# EAGLE design DummyLoad (EAGLE 7.2.0)
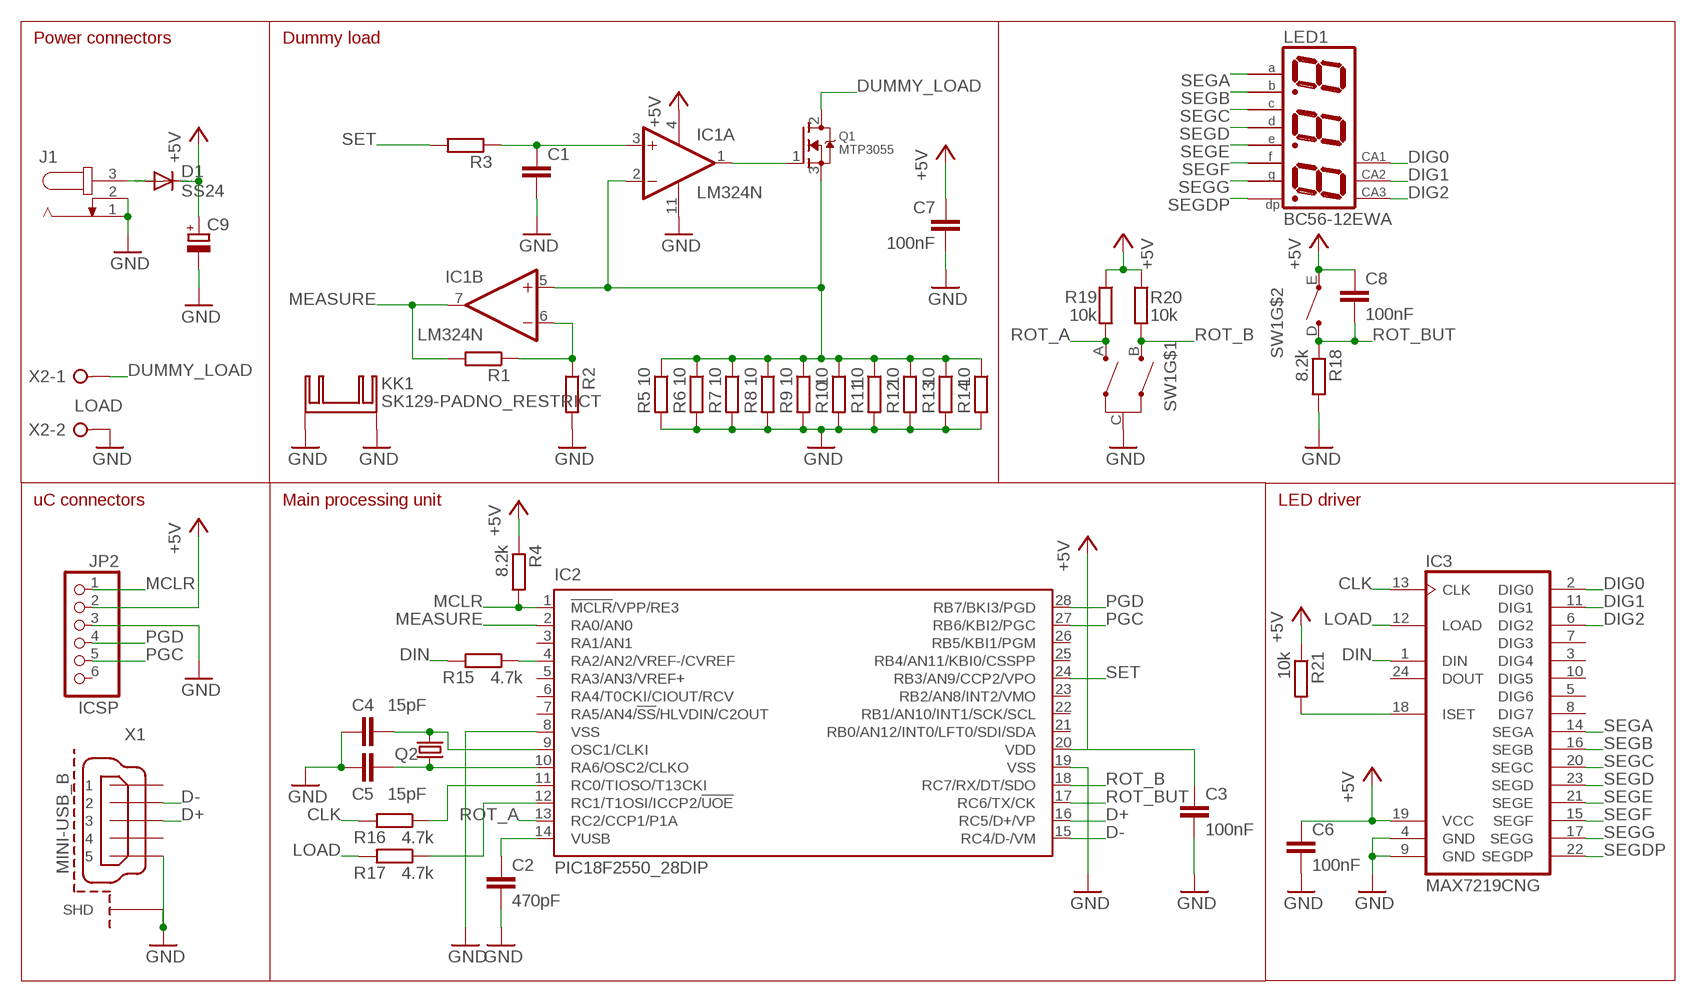
[diagram p0: schematic, sheet 1]

## Parts
C1  C-EUC1206  [C1206]
C2  470pF  C-EUC1206  [C1206]
C3  100nF  C-EUC1206  [C1206]
C4  15pF  C-EUC1206  [C1206]
C5  15pF  C-EUC1206  [C1206]
C6  100nF  C-EUC1206  [C1206]
C7  100nF  C-EUC1206  [C1206]
C8  100nF  C-EUC1206  [C1206]
C9  CPOL-EUD/7343-31R  [D/7343-31R]
D1  SS24  DIODE-DO214AA  [DO214AA]
IC1  LM324N  [DIL14]
IC2  PIC18F2550_28DIP  [DIL28-3]
IC3  MAX7219CNG  [DIL24-3]
J1  JACK-PLUG0  [SPC4077]
JP2  ICSP  PINHD-1X6/90  [1X06/90]
KK1  SK129-PADNO_RESTRICT  [SK129-NO_RESTRICT]
LED1  BC56-12EWA  [BX56-12]
Q1  MTP3055  MOSFET-NGDS_TO220V  [TO220V]
Q2  CRYSTALHC49S  [HC49/S]
R1  R-EU_R1206  [R1206]
R2  R-EU_R1206  [R1206]
R3  R-EU_R1206  [R1206]
R4  8.2k  R-EU_R1206  [R1206]
R5  10  R-EU_0309/12  [0309/12]
R6  10  R-EU_0309/12  [0309/12]
R7  10  R-EU_0309/12  [0309/12]
R8  10  R-EU_0309/12  [0309/12]
R9  10  R-EU_0309/12  [0309/12]
R10  10  R-EU_0309/12  [0309/12]
R11  10  R-EU_0309/12  [0309/12]
R12  10  R-EU_0309/12  [0309/12]
R13  10  R-EU_0309/12  [0309/12]
R14  10  R-EU_0309/12  [0309/12]
R15  4.7k  R-EU_R1206  [R1206]
R16  4.7k  R-EU_R1206  [R1206]
R17  4.7k  R-EU_R1206  [R1206]
R18  8.2k  R-EU_R1206  [R1206]
R19  10k  R-EU_R1206  [R1206]
R20  10k  R-EU_R1206  [R1206]
R21  10k  R-EU_R1206  [R1206]
SW1  EC11B-V-T  [EC11B-V]
X1  MINI-USB_B  [MINI-USB-B]
X2  LOAD  W237-02P  [W237-132]

## Nets
+5V: C3.1 C6.1 C7.1 C8.1 C9.+ D1.C IC1.4(P:V+) IC2.20(VDD) IC3.19(VCC) JP2.2 R4.1 R19.1 R20.1 R21.1 SW1.E
CLK: IC3.13(CLK) R16.2
D+: IC2.16(RC5/D+/VP) X1.3
D-: IC2.15(RC4/D-/VM) X1.2
DIG0: IC3.2(DIG0) LED1.12(CA)
DIG1: IC3.11(DIG1) LED1.9(CA)
DIG2: IC3.6(DIG2) LED1.8(CA)
DIN: IC3.1(DIN) R15.2
DUMMY_LOAD: Q1.2(D) X2.1
GND: C1.2 C2.2 C3.2 C4.1 C5.1 C6.2 C7.2 C9.- IC1.11(P:V-) IC2.8(VSS) IC2.19(VSS) IC3.4(GND) IC3.9(GND) J1.1 J1.2 JP2.3 KK1.A2,5(K) KK1.B2,5(K) R2.2 R5.2 R6.2 R7.2 R8.2 R9.2 R10.2 R11.2 R12.2 R13.2 R14.2 R18.2 SW1.C X1.5 X1.M1(SHD) X1.M2(SHD) X1.M3(SHD) X1.M4(SHD) X2.2
LOAD: IC3.12(LOAD) R17.2
MCLR: IC2.1(!MCLR!/VPP/RE3) JP2.1 R4.2
MEASURE: IC1.7(B:OUT) IC2.2(RA0/AN0) R1.2
N$1: IC1.1(A:OUT) Q1.1(G)
N$2: IC1.2(A:-IN) IC1.5(B:+IN) Q1.3(S) R5.1 R6.1 R7.1 R8.1 R9.1 R10.1 R11.1 R12.1 R13.1 R14.1
N$3: C4.2 IC2.9(OSC1/CLKI) Q2.2
N$4: IC1.6(B:-IN) R1.1 R2.1
N$5: C2.1 IC2.14(VUSB)
N$6: C1.1 IC1.3(A:+IN) R3.1
N$7: C5.2 IC2.10(RA6/OSC2/CLKO) Q2.1
N$8: IC2.4(RA2/AN2/VREF-/CVREF) R15.1
N$9: IC2.11(RC0/TIOSO/T13CKI) R16.1
N$10: IC2.12(RC1/T1OSI/ICCP2/!UOE) R17.1
N$11: D1.A J1.3
N$13: IC3.18(ISET) R21.2
PGC: IC2.27(RB6/KBI2/PGC) JP2.5
PGD: IC2.28(RB7/BKI3/PGD) JP2.4
ROT_A: IC2.13(RC2/CCP1/P1A) R19.2 SW1.A
ROT_B: IC2.18(RC7/RX/DT/SDO) R20.2 SW1.B
ROT_BUT: C8.2 IC2.17(RC6/TX/CK) R18.1 SW1.D
SEGA: IC3.14(SEGA) LED1.11(A)
SEGB: IC3.16(SEGB) LED1.7(B)
SEGC: IC3.20(SEGC) LED1.4(C)
SEGD: IC3.23(SEGD) LED1.2(D)
SEGDP: IC3.22(SEGDP) LED1.3(DP)
SEGE: IC3.21(SEGE) LED1.1(E)
SEGF: IC3.15(SEGF) LED1.10(F)
SEGG: IC3.17(SEGG) LED1.5(G)
SET: IC2.24(RB3/AN9/CCP2/VPO) R3.2
Unconnected: IC1.8(C:OUT) IC1.9(C:-IN) IC1.10(C:+IN) IC1.12(D:+IN) IC1.13(D:-IN) IC1.14(D:OUT) IC2.3(RA1/AN1) IC2.5(RA3/AN3/VREF+) IC2.6(RA4/T0CKI/CIOUT/RCV) IC2.7(RA5/AN4/!SS!/HLVDIN/C2OUT) IC2.21(RB0/AN12/INT0/LFT0/SDI/SDA) IC2.22(RB1/AN10/INT1/SCK/SCL) IC2.23(RB2/AN8/INT2/VMO) IC2.25(RB4/AN11/KBI0/CSSPP) IC2.26(RB5/KBI1/PGM) IC3.3(DIG4) IC3.5(DIG6) IC3.7(DIG3) IC3.8(DIG7) IC3.10(DIG5) IC3.24(DOUT) JP2.6 X1.1 X1.4

## Notes on the sheet
- Power connectors | Dummy load
- uC connectors | Main processing unit | LED driver

## Library data of the parts
C1-C8 = rcl:C-EU: CAPACITOR, European symbol
C9 = rcl:CPOL-EU: POLARIZED CAPACITOR, European symbol
D1 = diode:DIODE-: DIODE
IC1 = linear:LM324: OP AMP
IC2 = microchip:PIC18F2*_28: USB Microcontrollers with nanoWatt Technology High-Performance, Enhanced Flash, 28/40/44-Pin, Source: http://ww1.microchip.com/downloads/en/devicedoc/39632c.pdf; MF: MICROCHIP; MPN: PIC18F2550-I/SP; OC_FARNELL: 1523822; OC_NEWARK: 80K6054
IC3 = maxim:MAX7219CNG: LED DISPLAY DRIVER; MF: MAXIM; MPN: MAX7219CNG; OC_FARNELL: 1523914; OC_NEWARK: 34C4018
J1 = con-jack:JACK-PLUG: DC POWER JACK Power Jack, DC, Right Angle, Through Hole, Rated 5A at 16VDC, PC Terminals Distributor: Farnell (www.Farnell.de) Drawing: 84N1161.pdf / 84N1162.pdf Manufacturer: SPC Technology (www.spctechnology.com) Type: SPC4077 / SPC 4078; OC_FARNELL: unknown; OC_NEWARK: unknown
JP2 = pinhead:PINHD-1X6: PIN HEADER
KK1 = own-collection:SK129-PAD: HEATSINK manufacturer Fischer/distributor Buerklin
LED1 = display-kingbright:B?56-12*WA: 14.22mm (0.56INCH) THREE DIGIT NUMERIC DISPLAY Source: http://www.kingbright.com .. BA56-11EWA(Ver1189474895.pdf; OC_FARNELL: unknown; OC_NEWARK: unknown
Q1 = adafruit:MOSFET-N: N-Channel Mosfet 2N7002E - 60V 260mA SOT23 [Digikey: 2N7002ET1GOSTR-ND] - REEL BSH103 - 30V 850mA SOT23 [Digikey: 568-5013-1-ND]
Q2 = adafruit:CRYSTAL: CRYSTAL; OC_FARNELL: 1667008; OC_NEWARK: unknown
R1-R21 = rcl:R-EU_: RESISTOR, European symbol
SW1 = alps:EC11B-V-T: ALPS EC11B Vertikal mit Taster Drehimpulsgeber 11mm
X1 = own-collection:MINI-USB_B: MINI USB-B R/A DIP 5pol. Source: www.cypressindustries.com
X2 = con-wago-508:W237-02P: WAGO SREW CLAMP; OC_FARNELL: unknown; OC_NEWARK: unknown

## Board
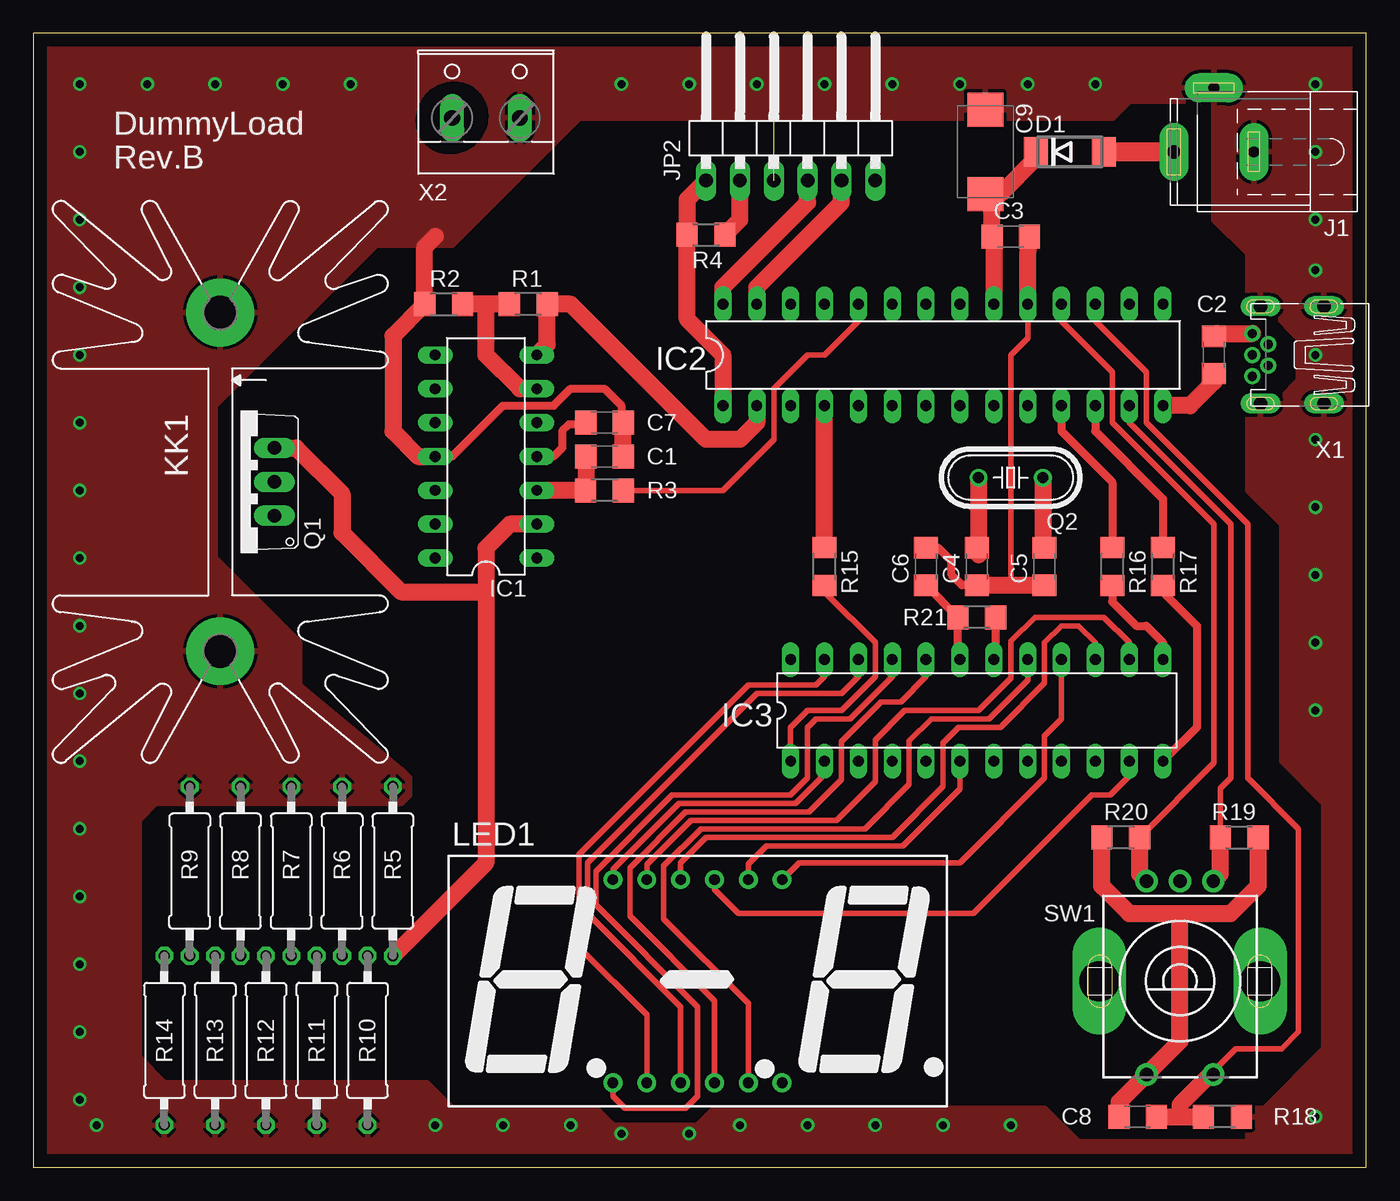
[diagram p1: board, top side]
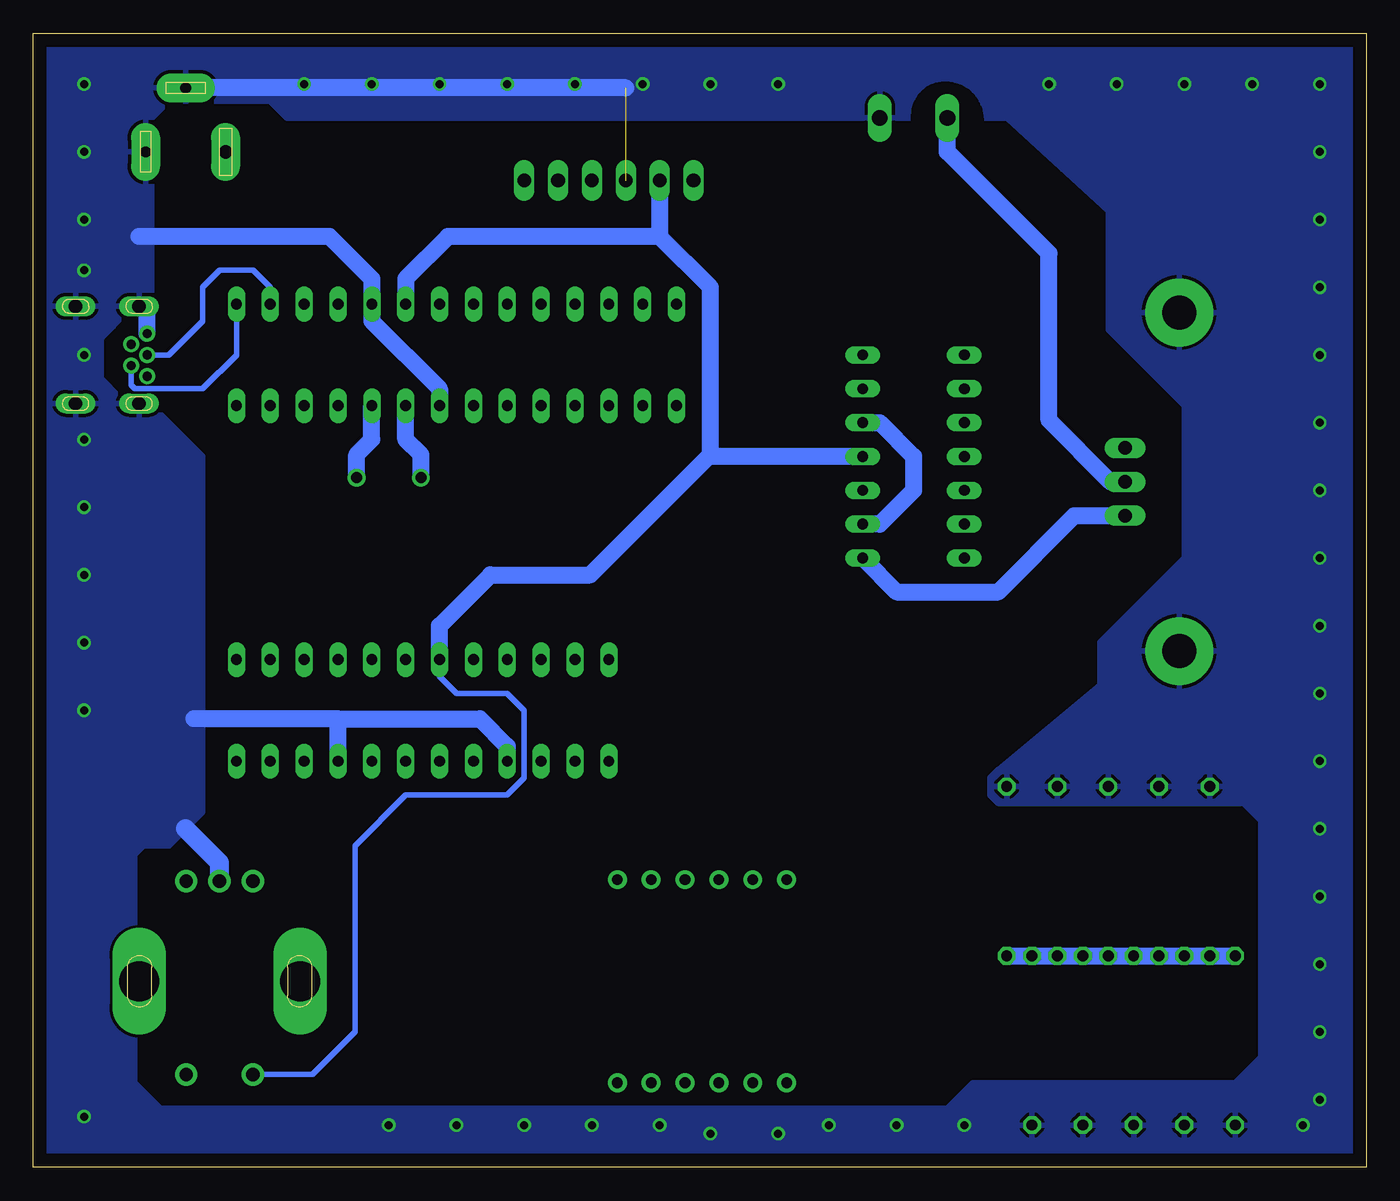
[diagram p2: board, bottom side, seen from below]

Size 100 x 85.08 mm. Coordinates in mm from the lower left corner, seen from the top.
Outline: 100,85.08 0,85.08 0,0 100,0 100,85.08
Copper layers (1*16): Top 0.035mm / dielectric 1.5mm / Bottom 0.035mm
Design rules "default": minimum track width 10mil, minimum drill 24mil, track to track 8mil, track to pad 8mil, pad to pad 8mil, via to via 8mil, smd to smd 8mil, copper to edge 40mil, drill to drill 8mil, minimum pad ring 10mil, minimum via ring 8mil, stop-mask expansion 4mil, vias tented up to drill 0mil, thermal gap 10mil

### Footprints (pad centres in the part's own frame; a part is rotated, then mirrored left to right if it is on the bottom)
C1206 = smd 1.6 x 1.8: 1 -1.4,0; 2 1.4,0
D/7343-31R = smd 2.55 x 2.7: + 3.175,0; - -3.175,0
DO214AA = smd 1.8 x 2.2: A 2.55,0; C -2.55,0
DIL14 = drill 0.813 long: 1 -7.62,-3.81; 2 -5.08,-3.81; 3 -2.54,-3.81; 4 0,-3.81; 5 2.54,-3.81; 6 5.08,-3.81; 7 7.62,-3.81; 8 7.62,3.81; 9 5.08,3.81; 10 2.54,3.81; 11 0,3.81; 12 -2.54,3.81; 13 -5.08,3.81; 14 -7.62,3.81
DIL28-3 = drill 0.813 long: 1 -16.51,-3.81; 2 -13.97,-3.81; 3 -11.43,-3.81; 4 -8.89,-3.81; 5 -6.35,-3.81; 6 -3.81,-3.81; 7 -1.27,-3.81; 8 1.27,-3.81; 9 3.81,-3.81; 10 6.35,-3.81; 11 8.89,-3.81; 12 11.43,-3.81; 13 13.97,-3.81; 14 16.51,-3.81; 15 16.51,3.81; 16 13.97,3.81; 17 11.43,3.81; 18 8.89,3.81; 19 6.35,3.81; 20 3.81,3.81; 21 1.27,3.81; 22 -1.27,3.81; 23 -3.81,3.81; 24 -6.35,3.81; 25 -8.89,3.81; 26 -11.43,3.81; 27 -13.97,3.81; 28 -16.51,3.81
DIL24-3 = drill 0.813 long: 1 -13.97,-3.81; 2 -11.43,-3.81; 3 -8.89,-3.81; 4 -6.35,-3.81; 5 -3.81,-3.81; 6 -1.27,-3.81; 7 1.27,-3.81; 8 3.81,-3.81; 9 6.35,-3.81; 10 8.89,-3.81; 11 11.43,-3.81; 12 13.97,-3.81; 13 13.97,3.81; 14 11.43,3.81; 15 8.89,3.81; 16 6.35,3.81; 17 3.81,3.81; 18 1.27,3.81; 19 -1.27,3.81; 20 -3.81,3.81; 21 -6.35,3.81; 22 -8.89,3.81; 23 -11.43,3.81; 24 -13.97,3.81
SPC4077 = drill 0.8 pad 2.184 long: 1 -3,0; 2 0,-4.8 | drill 1 pad 2.184 long: 3 3,0
1X06/90 = drill 1.016 long: 1 -6.35,-3.81; 2 -3.81,-3.81; 3 -1.27,-3.81; 4 1.27,-3.81; 5 3.81,-3.81; 6 6.35,-3.81
SK129-NO_RESTRICT = drill 2.54 pad 5.08: A2,5 -12.7,-0.254; B2,5 12.7,-0.254
BX56-12 = drill 0.8 pad 1.422: 1 -6.35,-7.62; 2 -3.81,-7.62; 3 -1.27,-7.62; 4 1.27,-7.62; 5 3.81,-7.62; 6 6.35,-7.62; 7 6.35,7.62; 8 3.81,7.62; 9 1.27,7.62; 10 -1.27,7.62; 11 -3.81,7.62; 12 -6.35,7.62
TO220V = drill 1.016 long: 1 -2.54,-2.54; 2 0,-2.54; 3 2.54,-2.54
HC49/S = drill 0.813: 1 -2.413,0; 2 2.413,0
R1206 = smd 1.6 x 1.803: 1 -1.422,0; 2 1.422,0
0309/12 = drill 0.813 octagon: 1 -6.35,0; 2 6.35,0
EC11B-V = drill 1 pad 1.676: A -2.5,-7.5; B 2.5,-7.5; C 0,-7.5; D -2.5,7; E 2.5,7 | drill 3 pad 3.3 long: G1 -6.032,0; G2 6.032,0
MINI-USB-B = drill 0.7 pad 1.016: 1 4.095,1.6; 2 2.895,0.8; 3 4.095,0; 4 2.895,-0.8; 5 4.095,-1.6 | drill 1 pad 1.422 long: M1 3.49,3.65; M2 3.49,-3.65; M3 -1.272,-3.65; M4 -1.272,3.65
W237-132 = drill 1.194 long: 1 -2.54,-0.635; 2 2.54,-0.635

### Placement (x,y rotation side)
C1  42.85,53.33 0 top
C2  88.57,60.95 90 top
C3  73.33,69.84 0 top
C4  70.79,45.08 90 top
C5  75.87,45.08 90 top
C6  66.98,45.08 90 top
C7  42.85,55.87 0 top
C8  82.86,3.8 0 top
C9  71.42,76.19 270 top
D1  77.78,76.19 0 top
IC1  33.96,53.33 90 top
IC2  68.25,60.95 0 top
IC3  70.79,34.28 0 top
J1  88.57,76.19 180 top
JP2  56.82,77.84 0 top
KK1  14.28,51.43 270 top
LED1  49.84,13.96 0 top
Q1  15.54,51.43 90 top
Q2  73.33,51.74 180 top
R1  37.14,64.76 0 top
R2  30.79,64.76 180 top
R3  42.85,50.79 0 top
R4  50.47,69.97 180 top
R5  26.98,22.21 90 top
R6  23.17,22.21 90 top
R7  19.36,22.21 90 top
R8  15.54,22.21 90 top
R9  11.73,22.21 90 top
R10  25.07,9.52 270 top
R11  21.26,9.52 270 top
R12  17.45,9.52 270 top
R13  13.64,9.52 270 top
R14  9.83,9.52 270 top
R15  59.36,45.08 270 top
R16  80.95,45.08 270 top
R17  84.76,45.08 270 top
R18  89.2,3.8 0 top
R19  90.48,24.75 180 top
R20  81.59,24.75 0 top
R21  70.79,41.27 0 top
SW1  86.03,13.96 180 top
X1  95.56,60.95 180 top
X2  33.96,79.36 0 top

### Tracks (layer width: path | path; a pad name or v marks a point on that pad's centre or on a via)
+5V
  Top 0.61: 41.45,55.74 40.18,55.74 39.68,55.23 39.68,53.97 39.04,53.33 IC1.4 | IC3.19 69.37,38.09 R21.1 C6.1
  Top 0.813: 41.45,55.74 C7.1
  Top 1.27: IC2.20 72.06,69.84 C3.1 71.93,73.02 | R20.1 80.16,21.1 82.22,19.04 86.03,19.04 | 86.03,19.04 89.84,19.04 91.9,21.1 R19.1 | 86.03,19.04 86.03,9.46 SW1.E 81.45,4.88 C8.1 | D1.C 75.23,75.7 72.54,73.02 71.93,73.02 | 71.93,73.02 C9.+ | R4.1 53.01,71.08 JP2.2
  Bottom 0.406: IC3.19 69.52,36.82 68.25,35.55 64.44,35.55 63.17,34.28 63.17,29.2 64.44,27.93 72.06,27.93 75.87,24.12 75.87,10.15 79.05,6.98 83.52,6.98 SW1.E
  Bottom 1.27: 49.27,53.4 58.22,44.44 65.71,44.44 69.52,40.63 IC3.19 | 49.27,53.4 49.2,53.46 49.2,66.03 53.01,69.84 | 53.01,69.84 68.89,69.84 72.06,66.66 IC2.20 | IC1.4 49.27,53.33 49.27,53.4 | JP2.2 53.01,69.84
CLK
  Top 0.61: R16.2 80.95,42.43 82.75,40.63 83.49,40.63 84.76,39.36 IC3.13
D+
  Bottom 0.406: X1.3 89.84,60.95 87.3,63.49 87.3,66.03 86.03,67.3 83.49,67.3 82.22,66.03 IC2.16
D-
  Bottom 0.406: X1.2 92.66,58.69 92.38,58.41 87.3,58.41 84.76,60.95 IC2.15
DIG0
  Top 0.406: LED1.12 43.48,22.33 48.45,27.29 57.19,27.29 59.36,29.46 IC3.2
DIG1
  Top 0.406: LED1.9 51.11,20.84 52.9,19.04 70.54,19.04 79.43,27.93 80.8,27.93 82.22,29.35 IC3.11
DIG2
  Top 0.406: LED1.8 53.65,22.75 55.02,24.12 65.26,24.12 69.52,28.38 IC3.6
DIN
  Top 0.406: IC3.1 56.82,33.01 58.09,34.28 60.63,34.28 63.17,36.82 63.17,39.36 59.51,43.02 R15.2
DUMMY_LOAD
  Bottom 1.27: Q1.2 19.18,51.43 23.8,56.05 23.8,68.57 31.42,76.19 X2.1
GND  (via drill 0.6)  (1 unrouted)
  Top 0.406: C5.1 75.74,43.17 | 73.33,43.68 73.33,60.95 74.6,62.22 IC2.19
  Top 0.61: IC1.11 31.42,53.33 35.23,57.14 39.04,57.14 40.31,58.41 42.85,58.41 44.12,57.14 44.12,56 C7.2 | C4.1 69.65,43.68 68.89,44.44 68.89,45.48 67.89,46.48 C6.2
  Top 1.27: C2.2 88.77,62.55 X1.5 | C1.2 C7.2 | R2.2 29.36,64.61 | C4.1 73.33,43.68 C5.1 | IC2.19 74.6,68.44 C3.2 | IC1.11 28.88,53.33 26.98,55.23 26.98,62.37 R2.2 | R2.2 29.36,69.05 30.15,69.84
  Bottom 1.27: 92.06,69.84 77.78,69.84 74.6,66.66 IC2.19 74.6,63.49 69.52,58.41 IC2.8 | X1.5 91.46,64.6 X1.M2 | 55.55,80.99 J1.2 | IC3.9 77.14,33.65 | 77.14,33.65 87.94,33.65 | 77.14,33.65 66.5,33.65 64.44,31.59 IC3.4
  Bottom 1.422: SW1.C 86.03,22.85 88.57,25.39
  other vias: 96.19,39.36 96.19,34.28 96.19,44.44 96.19,49.52 96.19,54.6 96.19,60.95 96.19,67.3 96.19,71.11 96.19,76.19 96.19,81.27 79.68,81.27 74.6,81.27 69.52,81.27 64.44,81.27 59.36,81.27 54.28,81.27 49.2,81.27 44.12,81.27 3.48,81.27 3.48,76.19 3.48,71.11 3.48,66.03 3.48,60.95 3.48,55.87 3.48,30.47 3.48,25.39 3.48,20.31 3.48,15.23 3.48,10.15 3.48,5.07 4.75,3.17 96.19,3.8 73.33,3.17 68.25,3.17 63.17,3.17 58.09,3.17 53.01,3.17 49.2,2.53 44.12,2.53 40.31,3.17 35.23,3.17 30.15,3.17 8.56,81.27 13.64,81.27 18.72,81.27 23.8,81.27 3.48,35.55 3.48,40.63 3.48,45.71 3.48,50.79
  pour Bottom: -0.33,-0.01 100,-0.01 100,85.08 88.57,85.08 88.57,81.27 91.11,78.73 91.11,64.12 93.02,64.12 94.92,62.22 94.92,59.19 93.5,57.77 91.75,57.77 87.3,53.33 87.3,26.66 89.84,24.12 91.75,24.12 92.38,23.48 92.38,6.34 90.48,4.44 31.42,4.44 29.52,6.34 9.83,6.34 6.02,10.15 -0.33,10.15
  pour Bottom: 100,85.08 0.3,85.08 0.3,73.65 7.93,73.65 7.93,76.19 11.1,78.73 80.95,78.73 82.22,80 100,80
  pour Bottom: -0.33,-0.01 7.93,-0.01 7.93,85.08 -0.33,85.08
  pour Top: 100,85.08 100,-0.01 91.11,-0.01 91.11,4.44 92.38,4.44 96.83,8.88 96.83,27.29 93.65,30.47 93.65,48.25 91.11,50.79 91.11,57.77 93.65,57.77 94.92,59.05 94.92,62.22 93.02,64.12 91.11,64.12 91.11,68.57 88.57,71.11 88.57,85.08
  pour Top: -0.33,-0.01 -0.33,85.08 7.93,85.08 7.93,8.25 9.83,6.34 9.83,-0.01
  pour Top: 100,85.08 -0.33,85.08 -0.33,74.92 7.93,74.92 12.37,78.73 80.95,78.73 82.22,80 100,80
  pour Top: 100,-0.01 -0.33,-0.01 -0.33,6.34 29.52,6.34 31.42,4.44 42.22,4.44 43.48,3.17 49.84,3.17 51.11,4.44 75.87,4.44 78.41,1.9 100,1.9
  pour Top: 0.3,85.08 0.3,26.02 7.93,26.02 9.2,27.29 27.61,27.29 28.25,27.93 28.25,29.2 27.61,29.83 19.99,36.19 19.99,39.36 13.64,45.71 13.64,57.14 25.71,69.2 31.42,69.2 40.95,78.73 40.95,85.08
  pour Bottom: 0.3,85.08 0.3,26.02 7.93,26.02 9.2,27.29 27.61,27.29 28.25,27.93 28.25,29.2 27.61,29.83 19.99,36.19 19.99,39.36 13.64,45.71 13.64,57.14 19.36,62.86 19.36,71.74 26.98,78.73 26.98,85.08
LOAD
  Top 0.61: R17.2 84.91,43.02 87.3,40.63 87.3,33.01 IC3.12
MCLR
  Top 1.27: IC2.1 51.74,60.95 49.05,63.64 R4.2 49.05,72.61 JP2.1
MEASURE
  Top 1.27: IC2.2 54.28,55.87 53.01,54.6 50.47,54.6 40.31,64.76 R1.2 38.56,61.74 IC1.7
N$1
  Bottom 1.27: IC1.1 35.23,43.17 27.61,43.17 21.9,48.89 Q1.1
N$2
  Top 1.27: Q1.3 19.73,53.97 23.17,50.53 23.17,47.62 27.61,43.17 33.96,43.17 | 33.96,43.17 33.96,22.85 R5.1 | IC1.2 35.76,48.25 33.96,46.45 33.96,43.17
  Bottom 1.27: IC1.5 36.5,55.87 33.96,53.33 33.96,50.79 36.5,48.25 IC1.2 | R5.1 R10.1 R6.1 R11.1 R7.1 R12.1 R8.1 R13.1 R9.1 R14.1
N$3
  Top 1.27: Q2.2 70.92,45.97 C4.2
  Bottom 1.27: Q2.2 70.92,53.46 72.06,54.6 IC2.9
N$4
  Top 1.27: R1.1 33.96,64.76 | 33.96,64.76 R2.1 | IC1.6 36.5,58.41 33.96,60.95 33.96,64.76
N$5
  Top 1.27: C2.1 88.57,58.94 86.77,57.14 IC2.14
N$6
  Top 1.27: IC1.3 R3.1 41.45,50.81 C1.1
N$7
  Top 1.27: Q2.1 75.74,46.6 C5.2
  Bottom 1.27: Q2.1 75.74,53.46 74.6,54.6 IC2.10
N$8
  Top 1.27: R15.1 IC2.4
N$9
  Top 0.61: IC2.11 77.14,55.23 80.95,51.43 R16.1
N$10
  Top 0.61: IC2.12 79.68,55.23 84.76,50.16 R17.1
N$11
  Top 1.422: D1.A J1.3
N$12
  cutout Bottom: 28.88,78.58 arc90 31.27,76.19 arc90 33.96,78.88 arc90 31.57,81.27 arc90
  cutout Top: 31.17,76.19 31.27,76.19 arc90 33.96,78.88 arc90 31.57,81.27 arc90 28.88,78.58 28.88,78.48 arc90
N$13
  Top 0.61: IC3.18 72.21,38.09 R21.2
PGC
  Top 1.27: IC2.27 54.28,66.03 60.63,72.38 JP2.5
PGD
  Top 1.27: IC2.28 51.74,66.03 58.09,72.38 JP2.4
ROT_A
  Top 0.406: R19.2 89.05,28.41 89.84,29.2 89.84,48.25 82.22,55.87 IC2.13
  Top 1.27: SW1.A 89.05,21.98 R19.2
ROT_B
  Top 0.406: R20.2 88.57,30.32 88.57,48.25 80.95,55.87 80.95,59.68 77.14,63.49 IC2.18
  Top 1.27: SW1.B 83.01,21.98 R20.2
ROT_BUT
  Top 0.406: 88.31,6.96 90.23,8.88 93.65,8.88 94.92,10.15 94.92,25.39 91.11,29.2 91.11,48.25 83.49,55.87 83.49,59.68 79.68,63.49 IC2.17
  Top 1.27: C8.2 86.03,3.8 | 86.03,3.8 R18.1 | 86.03,3.8 86.03,4.68 88.31,6.96 SW1.D
SEGA
  Top 0.406: LED1.11 46.02,22.72 49.33,26.02 60.25,26.02 63.17,28.95 63.17,32.08 65.38,34.28 70.9,34.28 73.33,36.71 73.33,39.47 75.13,41.27 80.31,41.27 82.22,39.36 IC3.14
SEGB
  Top 0.406: LED1.7 57.45,22.85 69.52,22.85 75.87,29.2 75.87,32.38 77.14,33.65 IC3.16
SEGC
  Top 0.406: IC3.20 66.98,36.82 65.08,34.91 63.59,34.91 60.63,31.96 60.63,29.09 58.2,26.66 48.95,26.66 44.76,22.47 44.76,18.85 51.11,12.51 LED1.4
SEGD
  Top 0.406: IC3.23 59.36,36.82 58.73,36.19 53.65,36.19 40.95,23.48 40.95,16.5 46.02,11.42 LED1.2
SEGDP
  Top 0.406: LED1.3 48.57,12.05 41.58,19.04 41.58,22.85 54.28,35.55 60.63,35.55 61.9,36.82 IC3.22
SEGE
  Top 0.406: IC3.21 64.44,36.82 61.27,33.65 58.73,33.65 58.09,33.01 58.09,29.2 56.82,27.93 47.93,27.93 42.22,22.21 42.22,19.67 49.84,12.05 49.84,5.33 48.94,4.44 44.38,4.44 43.48,5.33 LED1.1
SEGF
  Top 0.406: LED1.10 48.57,22.85 50.47,24.75 64.44,24.75 68.25,28.56 68.25,31.85 69.41,33.01 72.54,33.01 75.87,36.34 75.87,39.36 77.14,40.63 78.41,40.63 79.68,39.36 IC3.15
SEGG
  Top 0.406: LED1.5 53.65,12.3 47.3,18.65 47.3,22.59 50.09,25.39 62.38,25.39 65.71,28.72 65.71,31.99 67.36,33.65 71.67,33.65 74.6,36.57 IC3.17
SET
  Top 0.406: IC2.24 61.9,63.49 59.36,60.95 58.09,60.95 55.55,58.41 55.55,54.6 51.74,50.79 R3.2

### Text on the board
tNames: DummyLoad | Rev.B